# Altium schematic sheet Audio_Codec.SchDoc
size A3; SheetNumber: 1; SheetTotal: 4
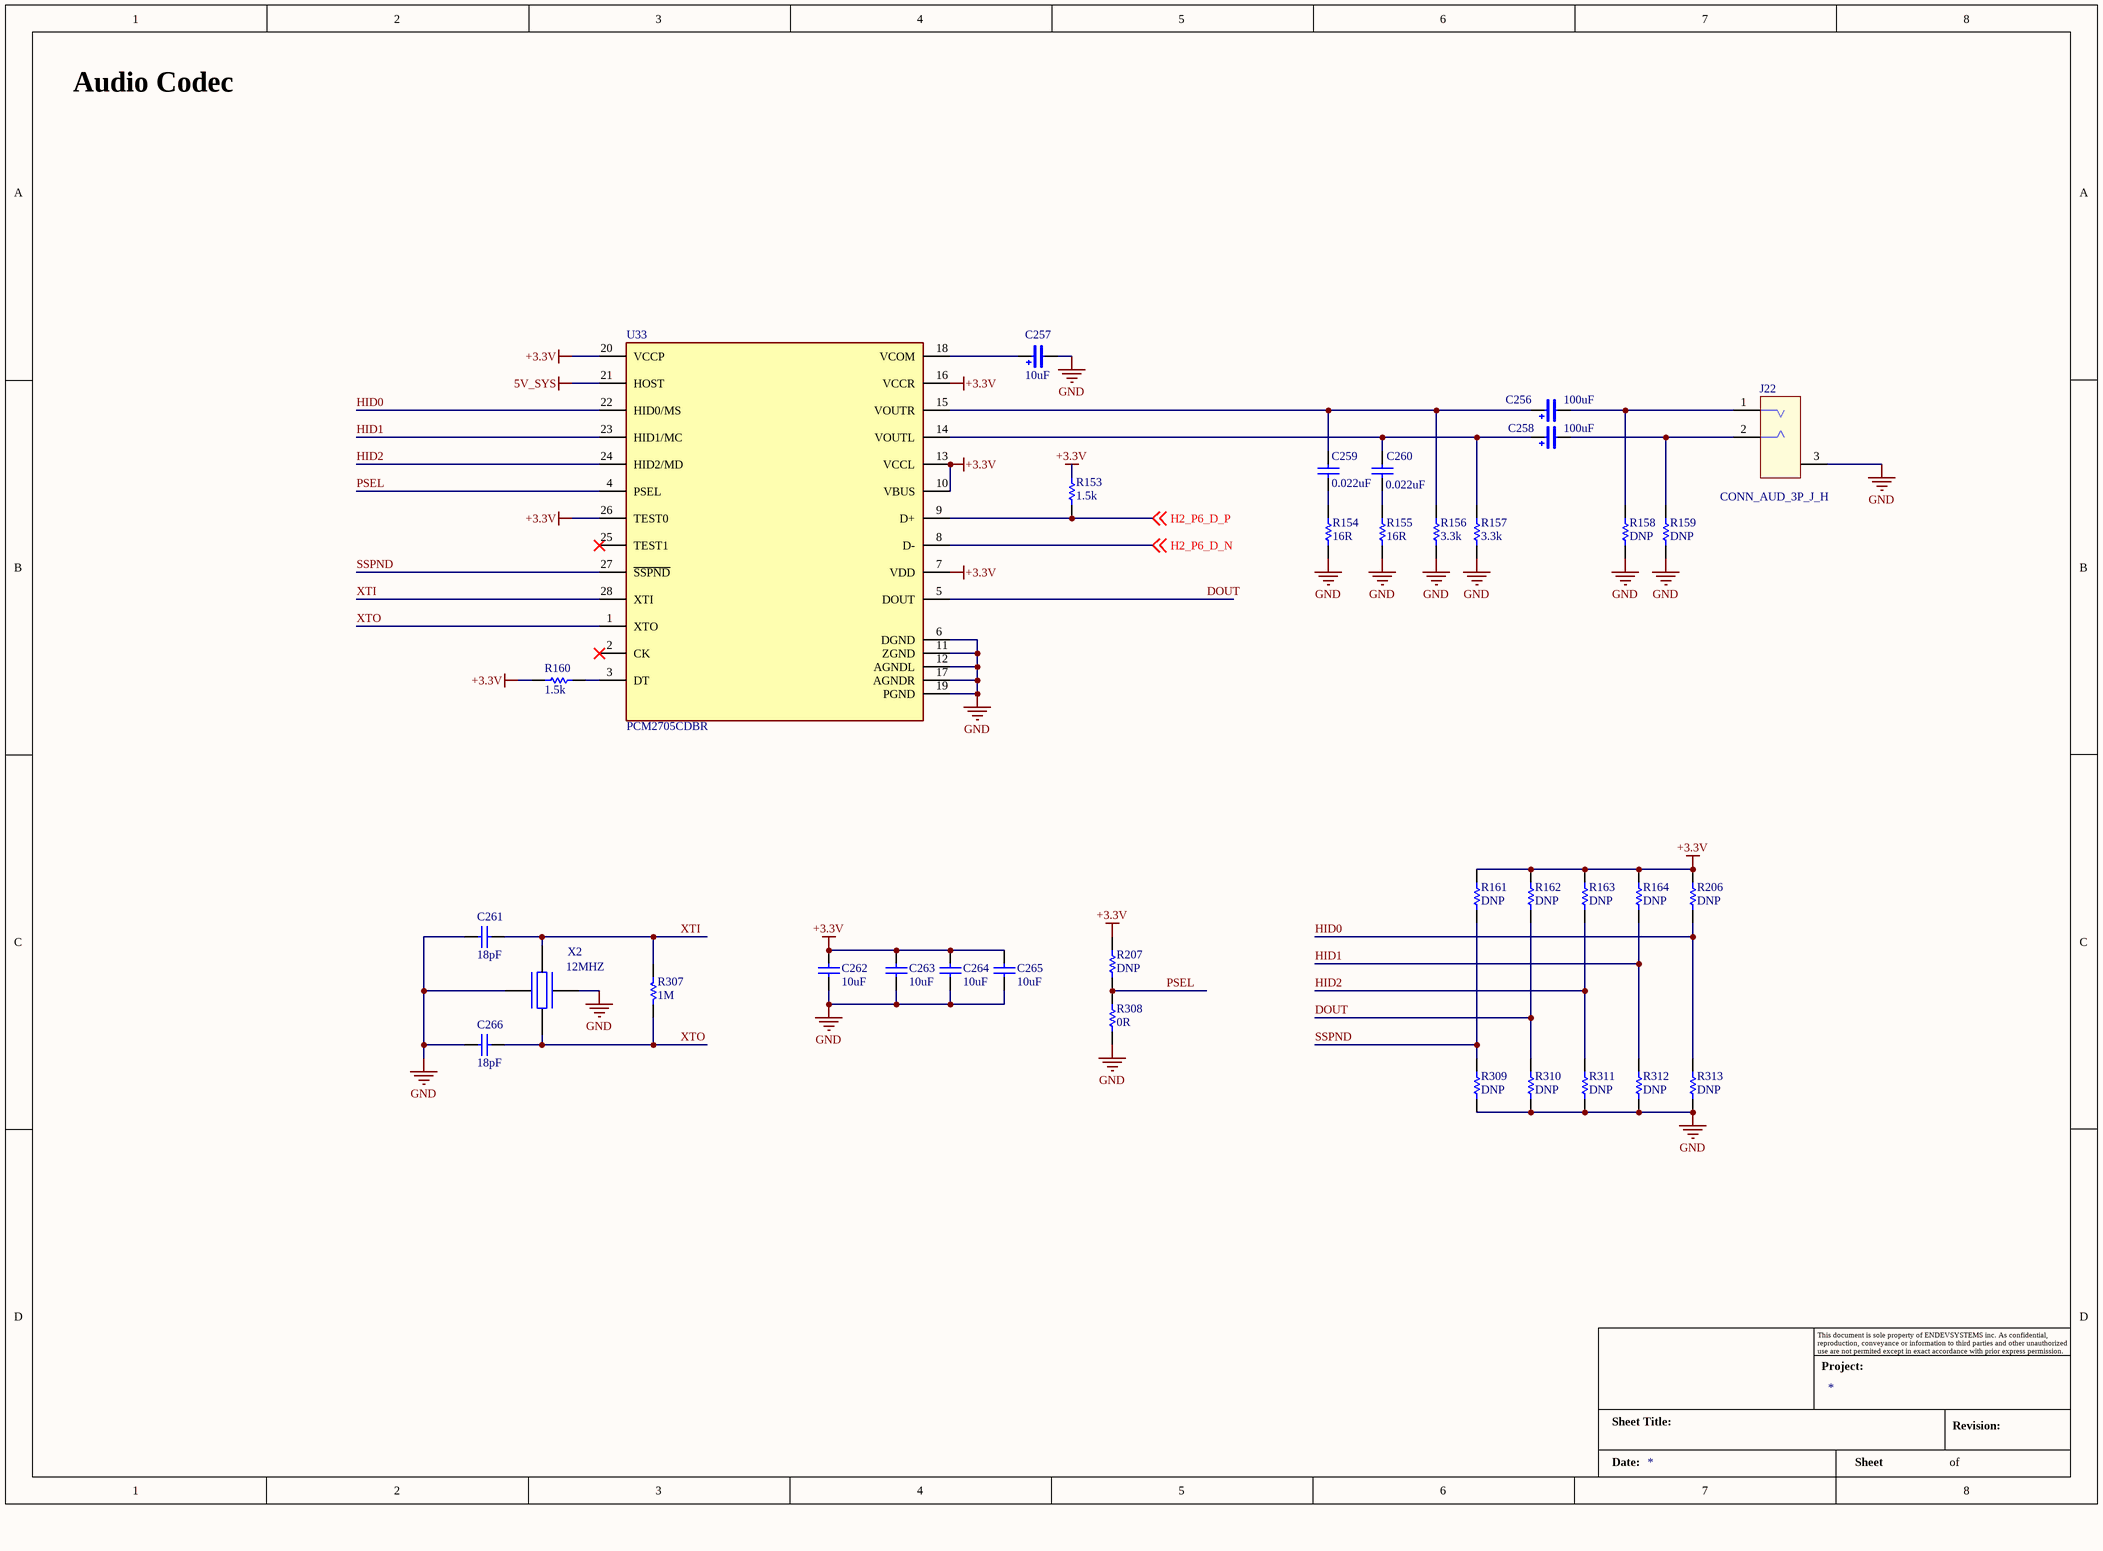
[diagram p0: Audio_Codec.SchDoc]

## Parts
?  Title_Block  (value not drawn)  (graphical)
C256  100uF  [C-1206 (Tantalum)]
C257  10uF  [C-1206 (Tantalum)]
C258  100uF  [C-1206 (Tantalum)]
C259  0.022uF  [CAP 1206/3216]
C260  0.022uF  [CAP 1206/3216]
C261  18pF  [CAP 1206/3216]
C262  10uF  [CAP 1206/3216]
C263  10uF  [CAP 1206/3216]
C264  10uF  [CAP 1206/3216]
C265  10uF  [CAP 1206/3216]
C266  18pF  [CAP 1206/3216]
J22  CONN_AUD_3P_J_H
R153  1.5k  [R-0402]
R154  16R  [R-0402]
R155  16R  [R-0402]
R156  3.3k  [R-0402]
R157  3.3k  [R-0402]
R158  DNP  [R-0402]
R159  DNP  [R-0402]
R160  1.5k  [R-0402]
R161  DNP  [R-0402]
R162  DNP  [R-0402]
R163  DNP  [R-0402]
R164  DNP  [R-0402]
R206  DNP  [R-0402]
R207  DNP  [R-0402]
R307  1M  [R-0402]
R308  0R  [R-0402]
R309  DNP  [R-0402]
R310  DNP  [R-0402]
R311  DNP  [R-0402]
R312  DNP  [R-0402]
R313  DNP  [R-0402]
U33  PCM2705CDBR  [SOP65P780X200-28N]
X2  12MHZ

## Nets
5V_SYS: U33.21(HOST)
+3.3V: C262.2 C263.2 C264.2 C265.2 R153.1 R160.1 R161.1 R162.1 R163.1 R164.1 R206.1 R207.1 U33.7(VDD) U33.10(VBUS) U33.13(VCCL) U33.16(VCCR) U33.20(VCCP) U33.26(TEST0)
GND: C257.- C261.2 C262.2 C263.2 C264.2 C265.2 C266.2 J22.3 R154.2 R155.2 R156.2 R157.2 R158.2 R159.2 R308.2 R309.1 R310.1 R311.1 R312.1 R313.1 U33.6(DGND) U33.11(ZGND) U33.12(AGNDL) U33.17(AGNDR) U33.19(PGND) X2.1(IN/OUT) X2.3(OUT/IN)
DOUT: R162.2 R310.2 U33.5(DOUT)
H2_P6_D_N: U33.8(D-) ; off-sheet H2_P6_D_N
H2_P6_D_P: R153.2 U33.9(D+) ; off-sheet H2_P6_D_P
HID0: R206.2 R313.2 U33.22(HID0/MS)
HID1: R164.2 R312.2 U33.23(HID1/MC)
HID2: R163.2 R311.2 U33.24(HID2/MD)
PSEL: R207.2 R308.1 U33.4(PSEL)
SSPND: R161.2 R309.2 U33.27(~{SSPND})
XTI: C261.2 R307.2 U33.28(XTI) X2.1(IN/OUT)
XTO: C266.2 R307.1 U33.1(XTO) X2.2(GND)
NetC256_+: C256.+ C259.2 R156.1 U33.15(VOUTR)
NetC256_-: C256.- J22.1 R158.1
NetC257_+: C257.+ U33.18(VCOM)
NetC258_+: C258.+ C260.2 R157.1 U33.14(VOUTL)
NetC258_-: C258.- J22.2 R159.1
NetC259_2: C259.2 R154.1
NetC260_2: C260.2 R155.1
NetR160_2: R160.2 U33.3(DT)

Not connected (* = marked no-connect by the designer): U33 2(CK)* 25(TEST1)*

## Notes on the sheet
- Audio Codec
- (in symbol Title_Block) This document is sole property of ENDEVSYSTEMS inc. As confidential, reproduction, conveyance or information to third parties and other unauthorized use are not permited except in exact accordance with prior express permission.; Project:; Sheet Title:; Revision:; Date:; Sheet; of

## Library data of the parts
C256-C258 = Capacitor-Polar: CAP TANT 10UF 10% 16V 1206; Mfr. Part No.: F931C106KAAAJ6; Unit Price (USD): 0.67; Value: 10uF 16V; Supplier Part No.: 478-10723-1-ND; Supplier: Digikey Electronics
C259-C266 = CAP 1206/3216: CAP CER 10UF 25V X5R 1206; Mfr. Part No.: C1206C106M3PACTU; Unit Price (USD): 0.28; Supplier Part No.: 399-8153-1-ND; Supplier: Digikey Electronics
R153-R164 R206 R207 R307-R313 = Resistor: RES SMD 51 OHM 0.5% 1/16W 0402; Mfr. Part No.: ERA-2AED510X; Value: 51R; Unit Price (USD): 0.21; Supplier Part No.: P51DECT-ND; Supplier: Digikey Electronics
U33 = PCM2705CDBR: 98dB SNR Stereo Full Speed DAC with line-out and S/PDIF output, Bus/Self-powered (S/W Control); MF: Texas Instruments; SnapEDA_Link: https://www.snapeda.com/parts/PCM2705CDBR/Texas+Instruments/view-part/?ref=snap; Package: SSOP-28 Texas Instruments; Value: *; MP: PCM2705CDBR; Check_prices: https://www.snapeda.com/parts/PCM2705CDBR/Texas+Instruments/view-part/?ref=eda
X2 = Crystal-4SMD: Mfr. Part No.: LIS2DHTR; Supplier: DigikeyElectronics
? = Title_Block: Date:: *; Project:: *